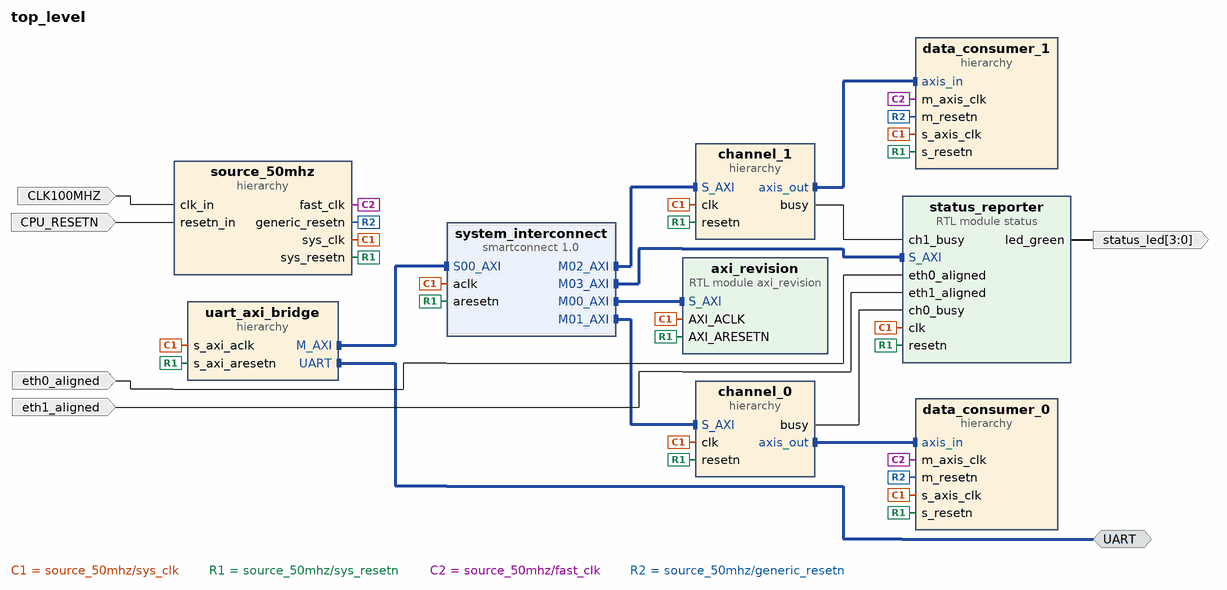
[diagram p0: block diagram of the top level]
# Vivado block design top_level, xc7a100tcsg324-1, Vivado 2021.1
create_bd_design top_level

create_bd_intf_port -mode Master -vlnv xilinx.com:interface:uart_rtl:1.0 UART
create_bd_port -dir I -type clk CLK100MHZ
create_bd_port -dir I -type rst CPU_RESETN
create_bd_port -dir O -from 3 -to 0 status_led
create_bd_port -dir I eth0_aligned
create_bd_port -dir I eth1_aligned

create_bd_cell -type hier source_50mhz
create_bd_cell -type hier uart_axi_bridge
create_bd_cell -type ip -vlnv xilinx.com:ip:smartconnect:1.0 system_interconnect
set_property -dict {CONFIG.NUM_MI 4 CONFIG.NUM_SI 1} [get_bd_cells system_interconnect]
create_bd_cell -type module -reference axi_revision axi_revision
create_bd_cell -type hier channel_0
create_bd_cell -type hier channel_1
create_bd_cell -type hier data_consumer_0
create_bd_cell -type hier data_consumer_1
create_bd_cell -type module -reference status status_reporter

# ---- hierarchy /source_50mhz ----
current_bd_instance /source_50mhz
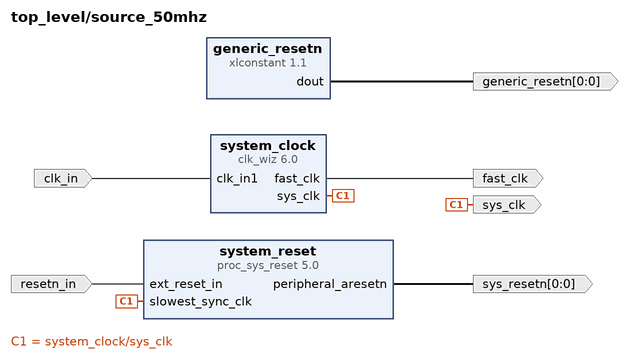
[diagram p1: block diagram inside /source_50mhz]
create_bd_pin -dir I -type clk clk_in
create_bd_pin -dir I -type rst resetn_in
create_bd_pin -dir O -type clk sys_clk
create_bd_pin -dir O -from 0 -to 0 sys_resetn
create_bd_pin -dir O fast_clk
create_bd_pin -dir O -from 0 -to 0 generic_resetn

create_bd_cell -type ip -vlnv xilinx.com:ip:clk_wiz:6.0 system_clock
set_property -dict [list \
  CONFIG.CLKOUT1_JITTER 207.083 \
  CONFIG.CLKOUT1_PHASE_ERROR 141.193 \
  CONFIG.CLKOUT1_REQUESTED_OUT_FREQ 50 \
  CONFIG.CLKOUT2_JITTER 196.281 \
  CONFIG.CLKOUT2_PHASE_ERROR 141.193 \
  CONFIG.CLKOUT2_REQUESTED_OUT_FREQ 62.98077 \
  CONFIG.CLKOUT2_USED true \
  CONFIG.CLK_OUT1_PORT sys_clk \
  CONFIG.CLK_OUT2_PORT fast_clk \
  CONFIG.MMCM_CLKFBOUT_MULT_F 16.375 \
  CONFIG.MMCM_CLKOUT0_DIVIDE_F 16.375 \
  CONFIG.MMCM_CLKOUT1_DIVIDE 13 \
  CONFIG.MMCM_DIVCLK_DIVIDE 2 \
  CONFIG.NUM_OUT_CLKS 2 \
  CONFIG.USE_LOCKED false \
  CONFIG.USE_RESET false \
] [get_bd_cells system_clock]
create_bd_cell -type ip -vlnv xilinx.com:ip:proc_sys_reset:5.0 system_reset
create_bd_cell -type ip -vlnv xilinx.com:ip:xlconstant:1.1 generic_resetn

# ---- hierarchy /uart_axi_bridge ----
current_bd_instance /uart_axi_bridge
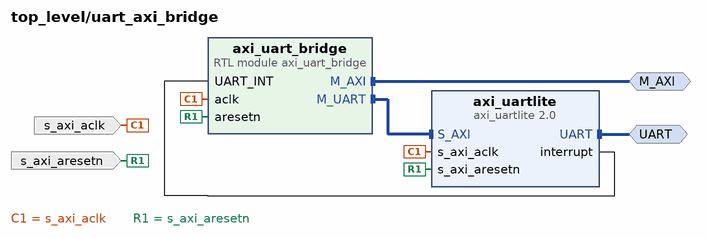
[diagram p2: block diagram inside /uart_axi_bridge]
create_bd_intf_pin -mode Master -vlnv xilinx.com:interface:uart_rtl:1.0 UART
create_bd_intf_pin -mode Master -vlnv xilinx.com:interface:aximm_rtl:1.0 M_AXI
create_bd_pin -dir I -type clk s_axi_aclk
create_bd_pin -dir I -type rst s_axi_aresetn

create_bd_cell -type module -reference axi_uart_bridge axi_uart_bridge
create_bd_cell -type ip -vlnv xilinx.com:ip:axi_uartlite:2.0 axi_uartlite
set_property -dict {CONFIG.C_BAUDRATE 115200} [get_bd_cells axi_uartlite]

# ---- hierarchy /channel_0 ----
current_bd_instance /channel_0
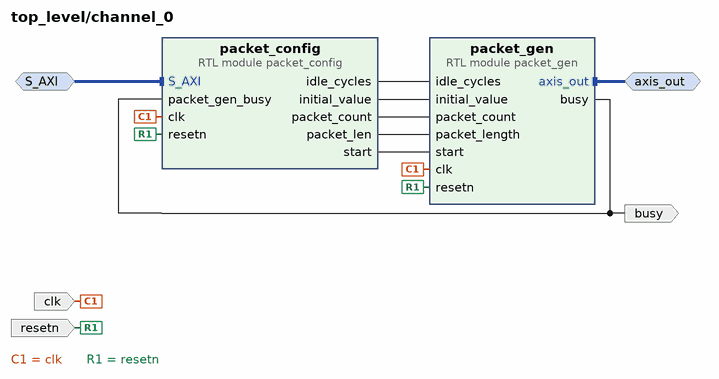
[diagram p3: block diagram inside /channel_0]
create_bd_intf_pin -mode Slave -vlnv xilinx.com:interface:aximm_rtl:1.0 S_AXI
create_bd_intf_pin -mode Master -vlnv xilinx.com:interface:axis_rtl:1.0 axis_out
create_bd_pin -dir I -type clk clk
create_bd_pin -dir I -type rst resetn
create_bd_pin -dir O busy

create_bd_cell -type module -reference packet_gen packet_gen
create_bd_cell -type module -reference packet_config packet_config

# ---- hierarchy /channel_1 ----
current_bd_instance /channel_1
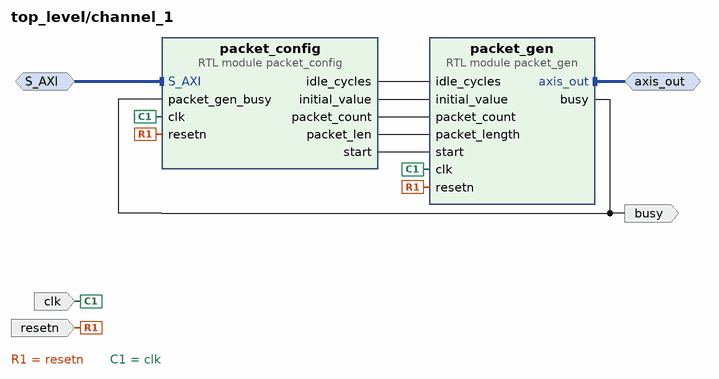
[diagram p4: block diagram inside /channel_1]
create_bd_intf_pin -mode Slave -vlnv xilinx.com:interface:aximm_rtl:1.0 S_AXI
create_bd_intf_pin -mode Master -vlnv xilinx.com:interface:axis_rtl:1.0 axis_out
create_bd_pin -dir I -type clk clk
create_bd_pin -dir I -type rst resetn
create_bd_pin -dir O busy

create_bd_cell -type module -reference packet_gen packet_gen
create_bd_cell -type module -reference packet_config packet_config
set_property -dict {CONFIG.DEFAULT_INIT_VALUE 0000000000000000} [get_bd_cells packet_config]

# ---- hierarchy /data_consumer_0 ----
current_bd_instance /data_consumer_0
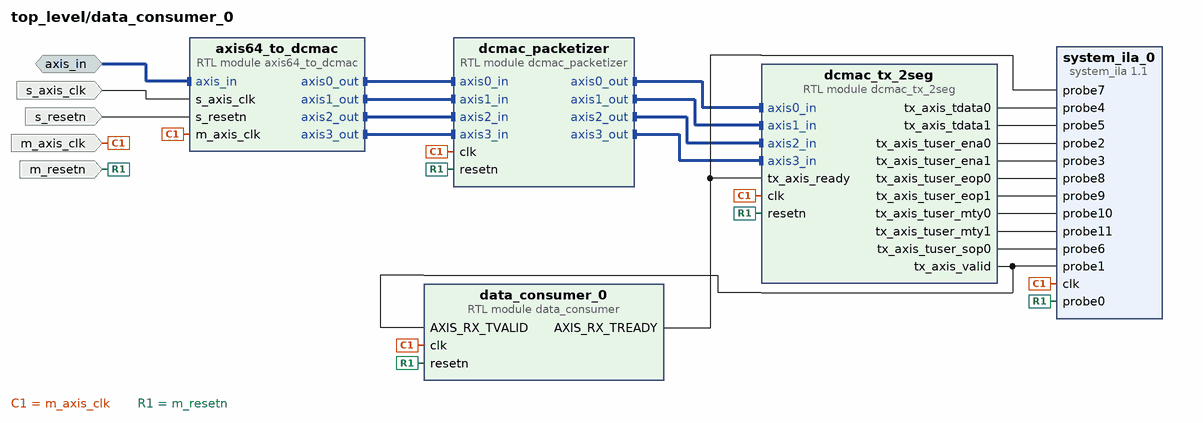
[diagram p5: block diagram inside /data_consumer_0]
create_bd_intf_pin -mode Slave -vlnv xilinx.com:interface:axis_rtl:1.0 axis_in
create_bd_pin -dir I s_axis_clk
create_bd_pin -dir I s_resetn
create_bd_pin -dir I m_axis_clk
create_bd_pin -dir I m_resetn

create_bd_cell -type module -reference axis64_to_dcmac axis64_to_dcmac
create_bd_cell -type ip -vlnv xilinx.com:ip:system_ila:1.1 system_ila_0
set_property -dict [list \
  CONFIG.ALL_PROBE_SAME_MU_CNT 2 \
  CONFIG.C_EN_STRG_QUAL 1 \
  CONFIG.C_MON_TYPE NATIVE \
  CONFIG.C_NUM_MONITOR_SLOTS 4 \
  CONFIG.C_NUM_OF_PROBES 15 \
  CONFIG.C_PROBE0_MU_CNT 2 \
  CONFIG.C_PROBE10_MU_CNT 2 \
  CONFIG.C_PROBE11_MU_CNT 2 \
  CONFIG.C_PROBE12_MU_CNT 2 \
  CONFIG.C_PROBE13_MU_CNT 2 \
  CONFIG.C_PROBE14_MU_CNT 2 \
  CONFIG.C_PROBE1_MU_CNT 2 \
  CONFIG.C_PROBE2_MU_CNT 2 \
  CONFIG.C_PROBE3_MU_CNT 2 \
  CONFIG.C_PROBE4_MU_CNT 2 \
  CONFIG.C_PROBE5_MU_CNT 2 \
  CONFIG.C_PROBE6_MU_CNT 2 \
  CONFIG.C_PROBE7_MU_CNT 2 \
  CONFIG.C_PROBE8_MU_CNT 2 \
  CONFIG.C_PROBE9_MU_CNT 2 \
  CONFIG.C_SLOT 3 \
  CONFIG.C_SLOT_0_INTF_TYPE xilinx.com:interface:axis_rtl:1.0 \
  CONFIG.C_SLOT_1_INTF_TYPE xilinx.com:interface:axis_rtl:1.0 \
  CONFIG.C_SLOT_2_INTF_TYPE xilinx.com:interface:axis_rtl:1.0 \
  CONFIG.C_SLOT_3_INTF_TYPE xilinx.com:interface:axis_rtl:1.0 \
] [get_bd_cells system_ila_0]
create_bd_cell -type module -reference data_consumer data_consumer_0
set_property -dict {CONFIG.NREADY_CYCLES 10 CONFIG.READY_CYCLES 5} [get_bd_cells data_consumer_0]
create_bd_cell -type module -reference dcmac_packetizer dcmac_packetizer
create_bd_cell -type module -reference dcmac_tx_2seg dcmac_tx_2seg

# ---- hierarchy /data_consumer_1 ----
current_bd_instance /data_consumer_1
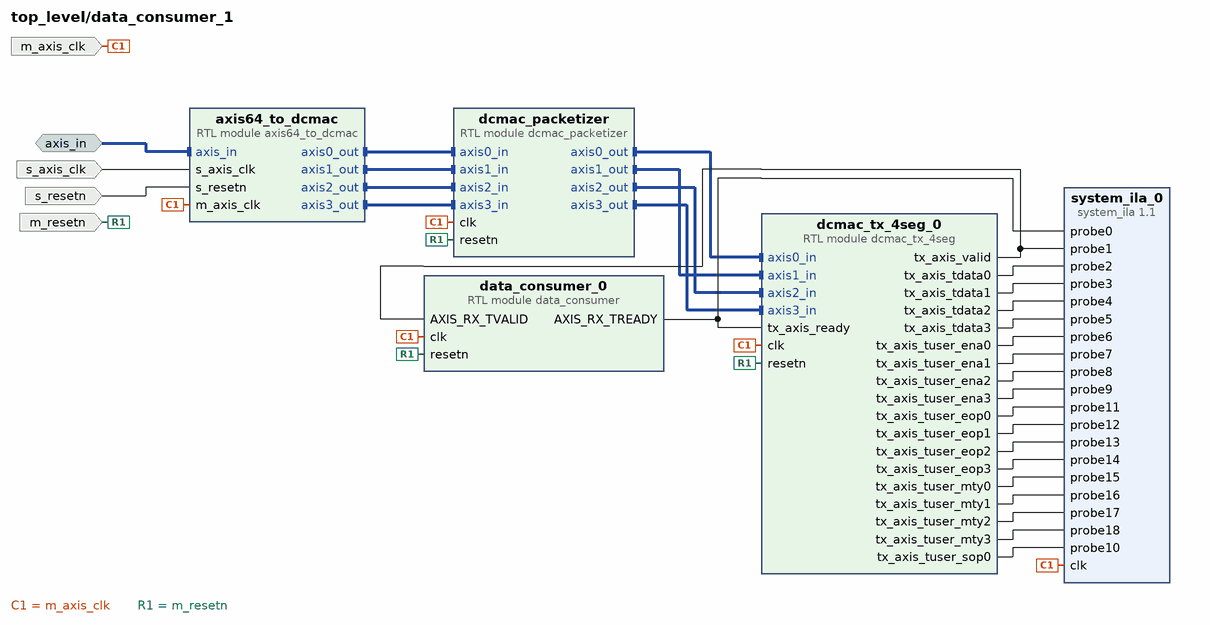
[diagram p6: block diagram inside /data_consumer_1]
create_bd_intf_pin -mode Slave -vlnv xilinx.com:interface:axis_rtl:1.0 axis_in
create_bd_pin -dir I s_axis_clk
create_bd_pin -dir I s_resetn
create_bd_pin -dir I m_axis_clk
create_bd_pin -dir I m_resetn

create_bd_cell -type module -reference axis64_to_dcmac axis64_to_dcmac
create_bd_cell -type ip -vlnv xilinx.com:ip:system_ila:1.1 system_ila_0
set_property -dict [list \
  CONFIG.ALL_PROBE_SAME_MU_CNT 2 \
  CONFIG.C_EN_STRG_QUAL 1 \
  CONFIG.C_MON_TYPE NATIVE \
  CONFIG.C_NUM_MONITOR_SLOTS 4 \
  CONFIG.C_NUM_OF_PROBES 19 \
  CONFIG.C_PROBE0_MU_CNT 2 \
  CONFIG.C_PROBE10_MU_CNT 2 \
  CONFIG.C_PROBE11_MU_CNT 2 \
  CONFIG.C_PROBE12_MU_CNT 2 \
  CONFIG.C_PROBE13_MU_CNT 2 \
  CONFIG.C_PROBE14_MU_CNT 2 \
  CONFIG.C_PROBE15_MU_CNT 2 \
  CONFIG.C_PROBE16_MU_CNT 2 \
  CONFIG.C_PROBE17_MU_CNT 2 \
  CONFIG.C_PROBE18_MU_CNT 2 \
  CONFIG.C_PROBE1_MU_CNT 2 \
  CONFIG.C_PROBE2_MU_CNT 2 \
  CONFIG.C_PROBE3_MU_CNT 2 \
  CONFIG.C_PROBE4_MU_CNT 2 \
  CONFIG.C_PROBE5_MU_CNT 2 \
  CONFIG.C_PROBE6_MU_CNT 2 \
  CONFIG.C_PROBE7_MU_CNT 2 \
  CONFIG.C_PROBE8_MU_CNT 2 \
  CONFIG.C_PROBE9_MU_CNT 2 \
  CONFIG.C_SLOT 3 \
  CONFIG.C_SLOT_0_INTF_TYPE xilinx.com:interface:axis_rtl:1.0 \
  CONFIG.C_SLOT_1_INTF_TYPE xilinx.com:interface:axis_rtl:1.0 \
  CONFIG.C_SLOT_2_INTF_TYPE xilinx.com:interface:axis_rtl:1.0 \
  CONFIG.C_SLOT_3_INTF_TYPE xilinx.com:interface:axis_rtl:1.0 \
] [get_bd_cells system_ila_0]
create_bd_cell -type module -reference data_consumer data_consumer_0
set_property -dict {CONFIG.NREADY_CYCLES 2 CONFIG.READY_CYCLES 7} [get_bd_cells data_consumer_0]
create_bd_cell -type module -reference dcmac_tx_4seg dcmac_tx_4seg_0
create_bd_cell -type module -reference dcmac_packetizer dcmac_packetizer

# ---- connections ----

current_bd_instance /source_50mhz
connect_bd_net -net clk_in1_0_1 [get_bd_pins clk_in] [get_bd_pins system_clock/clk_in1]
connect_bd_net -net ext_reset_in_0_1 [get_bd_pins resetn_in] [get_bd_pins system_reset/ext_reset_in]
connect_bd_net [get_bd_pins generic_resetn/dout] [get_bd_pins generic_resetn]
connect_bd_net -net system_clock_clk_100mhz [get_bd_pins system_clock/sys_clk] [get_bd_pins sys_clk] [get_bd_pins system_reset/slowest_sync_clk]
connect_bd_net [get_bd_pins system_clock/fast_clk] [get_bd_pins fast_clk]
connect_bd_net [get_bd_pins system_reset/peripheral_aresetn] [get_bd_pins sys_resetn]

current_bd_instance /uart_axi_bridge
connect_bd_intf_net [get_bd_intf_pins M_AXI] [get_bd_intf_pins axi_uart_bridge/M_AXI]
connect_bd_intf_net [get_bd_intf_pins axi_uart_bridge/M_UART] [get_bd_intf_pins axi_uartlite/S_AXI]
connect_bd_intf_net [get_bd_intf_pins UART] [get_bd_intf_pins axi_uartlite/UART]
connect_bd_net [get_bd_pins axi_uartlite/interrupt] [get_bd_pins axi_uart_bridge/UART_INT]
connect_bd_net -net source_100mhz_sys_clk [get_bd_pins s_axi_aclk] [get_bd_pins axi_uartlite/s_axi_aclk] [get_bd_pins axi_uart_bridge/aclk]
connect_bd_net -net source_100mhz_sys_resetn [get_bd_pins s_axi_aresetn] \
  [get_bd_pins axi_uartlite/s_axi_aresetn] [get_bd_pins axi_uart_bridge/aresetn]

current_bd_instance /channel_0
connect_bd_intf_net [get_bd_intf_pins axis_out] [get_bd_intf_pins packet_gen/axis_out]
connect_bd_intf_net [get_bd_intf_pins S_AXI] [get_bd_intf_pins packet_config/S_AXI]
connect_bd_net [get_bd_pins packet_config/idle_cycles] [get_bd_pins packet_gen/idle_cycles]
connect_bd_net [get_bd_pins packet_config/initial_value] [get_bd_pins packet_gen/initial_value]
connect_bd_net [get_bd_pins packet_config/packet_count] [get_bd_pins packet_gen/packet_count]
connect_bd_net [get_bd_pins packet_config/packet_len] [get_bd_pins packet_gen/packet_length]
connect_bd_net [get_bd_pins packet_config/start] [get_bd_pins packet_gen/start]
connect_bd_net [get_bd_pins packet_gen/busy] [get_bd_pins busy] [get_bd_pins packet_config/packet_gen_busy]
connect_bd_net -net source_100mhz_sys_clk [get_bd_pins clk] [get_bd_pins packet_gen/clk] [get_bd_pins packet_config/clk]
connect_bd_net -net source_100mhz_sys_resetn [get_bd_pins resetn] [get_bd_pins packet_gen/resetn] [get_bd_pins packet_config/resetn]

current_bd_instance /channel_1
connect_bd_intf_net [get_bd_intf_pins axis_out] [get_bd_intf_pins packet_gen/axis_out]
connect_bd_intf_net [get_bd_intf_pins S_AXI] [get_bd_intf_pins packet_config/S_AXI]
connect_bd_net [get_bd_pins packet_config/idle_cycles] [get_bd_pins packet_gen/idle_cycles]
connect_bd_net [get_bd_pins packet_config/initial_value] [get_bd_pins packet_gen/initial_value]
connect_bd_net [get_bd_pins packet_config/packet_count] [get_bd_pins packet_gen/packet_count]
connect_bd_net [get_bd_pins packet_config/packet_len] [get_bd_pins packet_gen/packet_length]
connect_bd_net [get_bd_pins packet_config/start] [get_bd_pins packet_gen/start]
connect_bd_net [get_bd_pins packet_gen/busy] [get_bd_pins busy] [get_bd_pins packet_config/packet_gen_busy]
connect_bd_net [get_bd_pins resetn] [get_bd_pins packet_gen/resetn] [get_bd_pins packet_config/resetn]
connect_bd_net -net source_100mhz_sys_clk [get_bd_pins clk] [get_bd_pins packet_gen/clk] [get_bd_pins packet_config/clk]

current_bd_instance /data_consumer_0
connect_bd_intf_net [get_bd_intf_pins dcmac_packetizer/axis0_in] [get_bd_intf_pins axis64_to_dcmac/axis0_out]
connect_bd_intf_net [get_bd_intf_pins dcmac_packetizer/axis1_in] [get_bd_intf_pins axis64_to_dcmac/axis1_out]
connect_bd_intf_net [get_bd_intf_pins dcmac_packetizer/axis2_in] [get_bd_intf_pins axis64_to_dcmac/axis2_out]
connect_bd_intf_net [get_bd_intf_pins dcmac_packetizer/axis3_in] [get_bd_intf_pins axis64_to_dcmac/axis3_out]
connect_bd_intf_net [get_bd_intf_pins axis_in] [get_bd_intf_pins axis64_to_dcmac/axis_in]
connect_bd_intf_net [get_bd_intf_pins dcmac_tx_2seg/axis0_in] [get_bd_intf_pins dcmac_packetizer/axis0_out]
connect_bd_intf_net [get_bd_intf_pins dcmac_tx_2seg/axis1_in] [get_bd_intf_pins dcmac_packetizer/axis1_out]
connect_bd_intf_net [get_bd_intf_pins dcmac_tx_2seg/axis2_in] [get_bd_intf_pins dcmac_packetizer/axis2_out]
connect_bd_intf_net [get_bd_intf_pins dcmac_tx_2seg/axis3_in] [get_bd_intf_pins dcmac_packetizer/axis3_out]
connect_bd_net [get_bd_pins data_consumer_0/AXIS_RX_TREADY] [get_bd_pins system_ila_0/probe7] [get_bd_pins dcmac_tx_2seg/tx_axis_ready]
connect_bd_net [get_bd_pins dcmac_tx_2seg/tx_axis_tdata0] [get_bd_pins system_ila_0/probe4]
connect_bd_net [get_bd_pins dcmac_tx_2seg/tx_axis_tdata1] [get_bd_pins system_ila_0/probe5]
connect_bd_net [get_bd_pins dcmac_tx_2seg/tx_axis_tuser_ena0] [get_bd_pins system_ila_0/probe2]
connect_bd_net [get_bd_pins dcmac_tx_2seg/tx_axis_tuser_ena1] [get_bd_pins system_ila_0/probe3]
connect_bd_net [get_bd_pins dcmac_tx_2seg/tx_axis_tuser_eop0] [get_bd_pins system_ila_0/probe8]
connect_bd_net [get_bd_pins dcmac_tx_2seg/tx_axis_tuser_eop1] [get_bd_pins system_ila_0/probe9]
connect_bd_net [get_bd_pins dcmac_tx_2seg/tx_axis_tuser_mty0] [get_bd_pins system_ila_0/probe10]
connect_bd_net [get_bd_pins dcmac_tx_2seg/tx_axis_tuser_mty1] [get_bd_pins system_ila_0/probe11]
connect_bd_net [get_bd_pins dcmac_tx_2seg/tx_axis_tuser_sop0] [get_bd_pins system_ila_0/probe6]
connect_bd_net [get_bd_pins dcmac_tx_2seg/tx_axis_valid] [get_bd_pins system_ila_0/probe1] [get_bd_pins data_consumer_0/AXIS_RX_TVALID]
connect_bd_net [get_bd_pins m_axis_clk] \
  [get_bd_pins axis64_to_dcmac/m_axis_clk] [get_bd_pins system_ila_0/clk] [get_bd_pins data_consumer_0/clk] \
  [get_bd_pins dcmac_packetizer/clk] [get_bd_pins dcmac_tx_2seg/clk]
connect_bd_net [get_bd_pins m_resetn] \
  [get_bd_pins system_ila_0/probe0] [get_bd_pins data_consumer_0/resetn] [get_bd_pins dcmac_packetizer/resetn] \
  [get_bd_pins dcmac_tx_2seg/resetn]
connect_bd_net [get_bd_pins s_axis_clk] [get_bd_pins axis64_to_dcmac/s_axis_clk]
connect_bd_net [get_bd_pins s_resetn] [get_bd_pins axis64_to_dcmac/s_resetn]

current_bd_instance /data_consumer_1
connect_bd_intf_net [get_bd_intf_pins dcmac_packetizer/axis0_in] [get_bd_intf_pins axis64_to_dcmac/axis0_out]
connect_bd_intf_net [get_bd_intf_pins dcmac_packetizer/axis1_in] [get_bd_intf_pins axis64_to_dcmac/axis1_out]
connect_bd_intf_net [get_bd_intf_pins dcmac_packetizer/axis2_in] [get_bd_intf_pins axis64_to_dcmac/axis2_out]
connect_bd_intf_net [get_bd_intf_pins dcmac_packetizer/axis3_in] [get_bd_intf_pins axis64_to_dcmac/axis3_out]
connect_bd_intf_net [get_bd_intf_pins axis_in] [get_bd_intf_pins axis64_to_dcmac/axis_in]
connect_bd_intf_net [get_bd_intf_pins dcmac_packetizer/axis0_out] [get_bd_intf_pins dcmac_tx_4seg_0/axis0_in]
connect_bd_intf_net [get_bd_intf_pins dcmac_packetizer/axis1_out] [get_bd_intf_pins dcmac_tx_4seg_0/axis1_in]
connect_bd_intf_net [get_bd_intf_pins dcmac_packetizer/axis2_out] [get_bd_intf_pins dcmac_tx_4seg_0/axis2_in]
connect_bd_intf_net [get_bd_intf_pins dcmac_packetizer/axis3_out] [get_bd_intf_pins dcmac_tx_4seg_0/axis3_in]
connect_bd_net [get_bd_pins data_consumer_0/AXIS_RX_TREADY] [get_bd_pins dcmac_tx_4seg_0/tx_axis_ready] [get_bd_pins system_ila_0/probe0]
connect_bd_net -net dcmac_tx_2seg_tx_axis_valid [get_bd_pins dcmac_tx_4seg_0/tx_axis_valid] \
  [get_bd_pins data_consumer_0/AXIS_RX_TVALID] [get_bd_pins system_ila_0/probe1]
connect_bd_net [get_bd_pins dcmac_tx_4seg_0/tx_axis_tdata0] [get_bd_pins system_ila_0/probe2]
connect_bd_net [get_bd_pins dcmac_tx_4seg_0/tx_axis_tdata1] [get_bd_pins system_ila_0/probe3]
connect_bd_net [get_bd_pins dcmac_tx_4seg_0/tx_axis_tdata2] [get_bd_pins system_ila_0/probe4]
connect_bd_net [get_bd_pins dcmac_tx_4seg_0/tx_axis_tdata3] [get_bd_pins system_ila_0/probe5]
connect_bd_net [get_bd_pins dcmac_tx_4seg_0/tx_axis_tuser_ena0] [get_bd_pins system_ila_0/probe6]
connect_bd_net [get_bd_pins dcmac_tx_4seg_0/tx_axis_tuser_ena1] [get_bd_pins system_ila_0/probe7]
connect_bd_net [get_bd_pins dcmac_tx_4seg_0/tx_axis_tuser_ena2] [get_bd_pins system_ila_0/probe8]
connect_bd_net [get_bd_pins dcmac_tx_4seg_0/tx_axis_tuser_ena3] [get_bd_pins system_ila_0/probe9]
connect_bd_net [get_bd_pins dcmac_tx_4seg_0/tx_axis_tuser_eop0] [get_bd_pins system_ila_0/probe11]
connect_bd_net [get_bd_pins dcmac_tx_4seg_0/tx_axis_tuser_eop1] [get_bd_pins system_ila_0/probe12]
connect_bd_net [get_bd_pins dcmac_tx_4seg_0/tx_axis_tuser_eop2] [get_bd_pins system_ila_0/probe13]
connect_bd_net [get_bd_pins dcmac_tx_4seg_0/tx_axis_tuser_eop3] [get_bd_pins system_ila_0/probe14]
connect_bd_net [get_bd_pins dcmac_tx_4seg_0/tx_axis_tuser_mty0] [get_bd_pins system_ila_0/probe15]
connect_bd_net [get_bd_pins dcmac_tx_4seg_0/tx_axis_tuser_mty1] [get_bd_pins system_ila_0/probe16]
connect_bd_net [get_bd_pins dcmac_tx_4seg_0/tx_axis_tuser_mty2] [get_bd_pins system_ila_0/probe17]
connect_bd_net [get_bd_pins dcmac_tx_4seg_0/tx_axis_tuser_mty3] [get_bd_pins system_ila_0/probe18]
connect_bd_net [get_bd_pins dcmac_tx_4seg_0/tx_axis_tuser_sop0] [get_bd_pins system_ila_0/probe10]
connect_bd_net [get_bd_pins m_axis_clk] \
  [get_bd_pins axis64_to_dcmac/m_axis_clk] [get_bd_pins system_ila_0/clk] [get_bd_pins data_consumer_0/clk] \
  [get_bd_pins dcmac_tx_4seg_0/clk] [get_bd_pins dcmac_packetizer/clk]
connect_bd_net [get_bd_pins m_resetn] [get_bd_pins data_consumer_0/resetn] [get_bd_pins dcmac_tx_4seg_0/resetn] [get_bd_pins dcmac_packetizer/resetn]
connect_bd_net [get_bd_pins s_axis_clk] [get_bd_pins axis64_to_dcmac/s_axis_clk]
connect_bd_net [get_bd_pins s_resetn] [get_bd_pins axis64_to_dcmac/s_resetn]

current_bd_instance /
connect_bd_intf_net [get_bd_intf_ports UART] [get_bd_intf_pins uart_axi_bridge/UART]
connect_bd_intf_net [get_bd_intf_pins data_consumer_1/axis_in] [get_bd_intf_pins channel_1/axis_out]
connect_bd_intf_net [get_bd_intf_pins channel_0/axis_out] [get_bd_intf_pins data_consumer_0/axis_in]
connect_bd_intf_net [get_bd_intf_pins system_interconnect/M00_AXI] [get_bd_intf_pins axi_revision/S_AXI]
connect_bd_intf_net [get_bd_intf_pins channel_0/S_AXI] [get_bd_intf_pins system_interconnect/M01_AXI]
connect_bd_intf_net [get_bd_intf_pins system_interconnect/M02_AXI] [get_bd_intf_pins channel_1/S_AXI]
connect_bd_intf_net [get_bd_intf_pins system_interconnect/M03_AXI] [get_bd_intf_pins status_reporter/S_AXI]
connect_bd_intf_net [get_bd_intf_pins uart_axi_bridge/M_AXI] [get_bd_intf_pins system_interconnect/S00_AXI]
connect_bd_net [get_bd_pins channel_0/busy] [get_bd_pins status_reporter/ch0_busy]
connect_bd_net [get_bd_pins channel_1/busy] [get_bd_pins status_reporter/ch1_busy]
connect_bd_net -net clk_in1_0_1 [get_bd_ports CLK100MHZ] [get_bd_pins source_50mhz/clk_in]
connect_bd_net [get_bd_ports eth0_aligned] [get_bd_pins status_reporter/eth0_aligned]
connect_bd_net [get_bd_ports eth1_aligned] [get_bd_pins status_reporter/eth1_aligned]
connect_bd_net -net ext_reset_in_0_1 [get_bd_ports CPU_RESETN] [get_bd_pins source_50mhz/resetn_in]
connect_bd_net -net source_100mhz_sys_clk [get_bd_pins source_50mhz/sys_clk] \
  [get_bd_pins uart_axi_bridge/s_axi_aclk] [get_bd_pins system_interconnect/aclk] [get_bd_pins axi_revision/AXI_ACLK] \
  [get_bd_pins channel_0/clk] [get_bd_pins channel_1/clk] [get_bd_pins data_consumer_0/s_axis_clk] \
  [get_bd_pins data_consumer_1/s_axis_clk] [get_bd_pins status_reporter/clk]
connect_bd_net -net source_100mhz_sys_resetn [get_bd_pins source_50mhz/sys_resetn] \
  [get_bd_pins uart_axi_bridge/s_axi_aresetn] [get_bd_pins system_interconnect/aresetn] \
  [get_bd_pins axi_revision/AXI_ARESETN] [get_bd_pins channel_0/resetn] [get_bd_pins channel_1/resetn] \
  [get_bd_pins data_consumer_0/s_resetn] [get_bd_pins data_consumer_1/s_resetn] [get_bd_pins status_reporter/resetn]
connect_bd_net [get_bd_pins source_50mhz/fast_clk] [get_bd_pins data_consumer_0/m_axis_clk] [get_bd_pins data_consumer_1/m_axis_clk]
connect_bd_net [get_bd_pins source_50mhz/generic_resetn] [get_bd_pins data_consumer_0/m_resetn] [get_bd_pins data_consumer_1/m_resetn]
connect_bd_net -net status_0_status_led [get_bd_pins status_reporter/led_green] [get_bd_ports status_led]

# ---- address map ----
assign_bd_address -offset 0x0000000000000000 -range 256 -target_address_space [get_bd_addr_spaces uart_axi_bridge/axi_uart_bridge/M_AXI] [get_bd_addr_segs axi_revision/S_AXI/reg0]
assign_bd_address -offset 0x0000000000001000 -range 256 -target_address_space [get_bd_addr_spaces uart_axi_bridge/axi_uart_bridge/M_AXI] [get_bd_addr_segs channel_0/packet_config/S_AXI/reg0]
assign_bd_address -offset 0x0000000000002000 -range 256 -target_address_space [get_bd_addr_spaces uart_axi_bridge/axi_uart_bridge/M_AXI] [get_bd_addr_segs channel_1/packet_config/S_AXI/reg0]
assign_bd_address -offset 0x0000000000003000 -range 256 -target_address_space [get_bd_addr_spaces uart_axi_bridge/axi_uart_bridge/M_AXI] [get_bd_addr_segs status_reporter/S_AXI/reg0]
assign_bd_address -offset 0x40600000 -range 64K -target_address_space [get_bd_addr_spaces uart_axi_bridge/axi_uart_bridge/M_UART] [get_bd_addr_segs uart_axi_bridge/axi_uartlite/S_AXI/Reg]

validate_bd_design
save_bd_design
